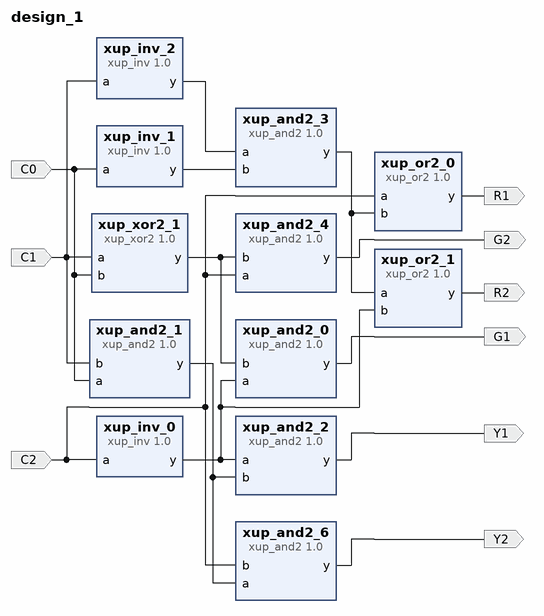
[diagram p0: block diagram of the top level]
# Vivado block design design_1, xc7a35tcpg236-1, Vivado 2019.1
create_bd_design design_1

create_bd_port -dir I C2
create_bd_port -dir I C0
create_bd_port -dir I C1
create_bd_port -dir O G1
create_bd_port -dir O Y1
create_bd_port -dir O R1
create_bd_port -dir O G2
create_bd_port -dir O Y2
create_bd_port -dir O R2

create_bd_cell -type ip -vlnv xilinx.com:xup:xup_inv:1.0 xup_inv_0
create_bd_cell -type ip -vlnv xilinx.com:xup:xup_and2:1.0 xup_and2_0
create_bd_cell -type ip -vlnv xilinx.com:xup:xup_and2:1.0 xup_and2_1
create_bd_cell -type ip -vlnv xilinx.com:xup:xup_and2:1.0 xup_and2_2
create_bd_cell -type ip -vlnv xilinx.com:xup:xup_inv:1.0 xup_inv_2
create_bd_cell -type ip -vlnv xilinx.com:xup:xup_and2:1.0 xup_and2_3
create_bd_cell -type ip -vlnv xilinx.com:xup:xup_or2:1.0 xup_or2_0
create_bd_cell -type ip -vlnv xilinx.com:xup:xup_xor2:1.0 xup_xor2_1
create_bd_cell -type ip -vlnv xilinx.com:xup:xup_and2:1.0 xup_and2_4
create_bd_cell -type ip -vlnv xilinx.com:xup:xup_and2:1.0 xup_and2_6
create_bd_cell -type ip -vlnv xilinx.com:xup:xup_or2:1.0 xup_or2_1
create_bd_cell -type ip -vlnv xilinx.com:xup:xup_inv:1.0 xup_inv_1

# ---- connections ----

connect_bd_net [get_bd_pins xup_and2_0/y] [get_bd_ports G1]
connect_bd_net [get_bd_pins xup_and2_3/y] [get_bd_pins xup_or2_0/b] [get_bd_pins xup_or2_1/a]
connect_bd_net [get_bd_pins xup_or2_0/y] [get_bd_ports R1]
connect_bd_net [get_bd_pins xup_xor2_1/y] [get_bd_pins xup_and2_4/b] [get_bd_pins xup_and2_0/b]
connect_bd_net [get_bd_pins xup_and2_4/y] [get_bd_ports G2]
connect_bd_net [get_bd_pins xup_and2_6/y] [get_bd_ports Y2]
connect_bd_net [get_bd_pins xup_or2_1/y] [get_bd_ports R2]
connect_bd_net [get_bd_pins xup_and2_2/y] [get_bd_ports Y1]
connect_bd_net [get_bd_pins xup_and2_1/y] [get_bd_pins xup_and2_2/b] [get_bd_pins xup_and2_6/a]
connect_bd_net -net C2_1 [get_bd_ports C2] [get_bd_pins xup_inv_0/a] [get_bd_pins xup_and2_4/a] [get_bd_pins xup_and2_6/b] [get_bd_pins xup_or2_0/a]
connect_bd_net [get_bd_pins xup_inv_0/y] [get_bd_pins xup_and2_0/a] [get_bd_pins xup_and2_2/a] [get_bd_pins xup_or2_1/b]
connect_bd_net -net C1_1 [get_bd_ports C1] [get_bd_pins xup_xor2_1/a] [get_bd_pins xup_and2_1/b] [get_bd_pins xup_inv_2/a]
connect_bd_net -net C0_1 [get_bd_ports C0] [get_bd_pins xup_and2_1/a] [get_bd_pins xup_xor2_1/b] [get_bd_pins xup_inv_1/a]
connect_bd_net [get_bd_pins xup_inv_2/y] [get_bd_pins xup_and2_3/a]
connect_bd_net [get_bd_pins xup_inv_1/y] [get_bd_pins xup_and2_3/b]

validate_bd_design
save_bd_design
